# Altium schematic sheet connectors.SchDoc
size 420 x 297 mm; SheetNumber: 5; SheetTotal: 6
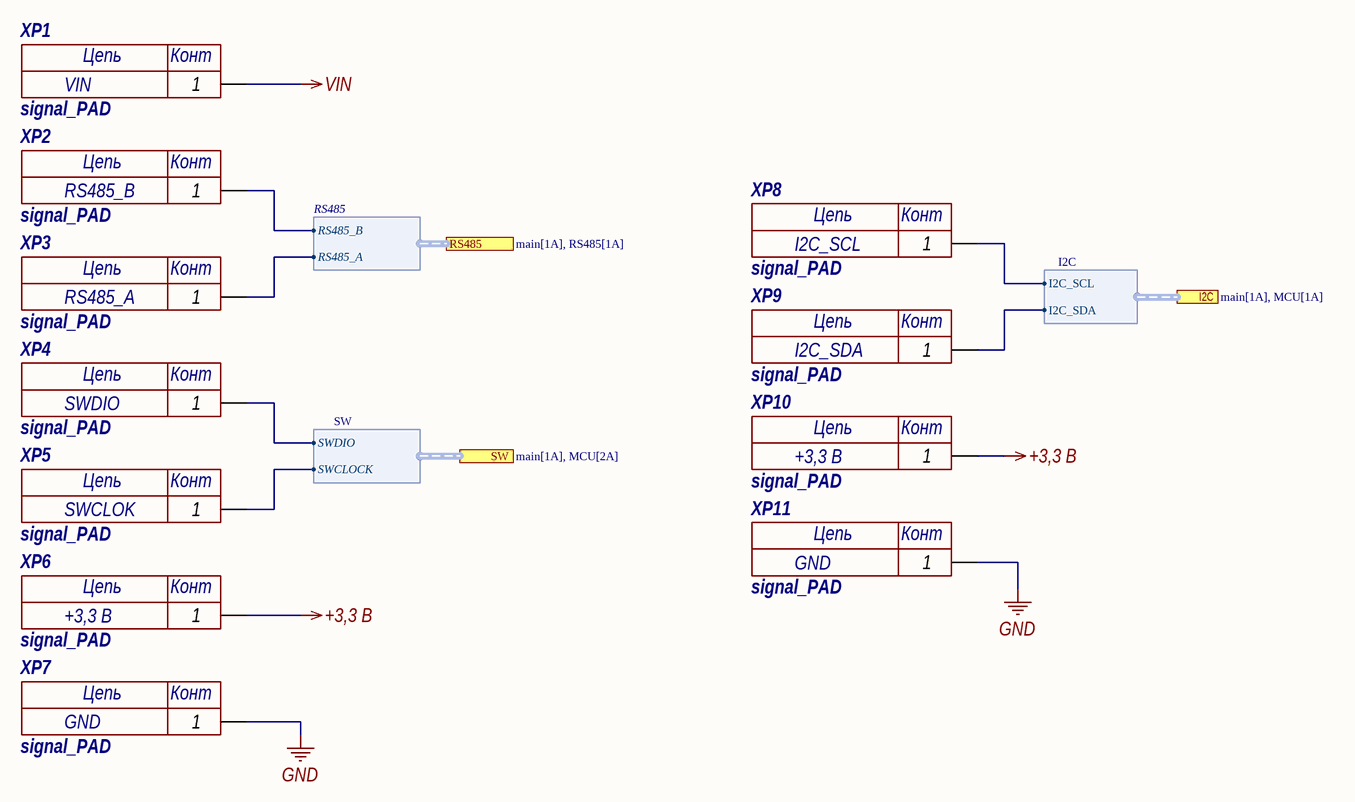
[diagram p0: connectors.SchDoc]

## Parts
XP1  signal_PAD  Value1: VIN  [SS_PAD]
XP2  signal_PAD  Value1: RS485_B  [SS_PAD]
XP3  signal_PAD  Value1: RS485_A  [SS_PAD]
XP4  signal_PAD  Value1: SWDIO  [SS_PAD]
XP5  signal_PAD  Value1: SWCLOK  [SS_PAD]
XP6  signal_PAD  Value1: +3,3 В  [SS_PAD]
XP7  signal_PAD  Value1: GND  [SS_PAD]
XP8  signal_PAD  Value1: I2C_SCL  [SS_PAD]
XP9  signal_PAD  Value1: I2C_SDA  [SS_PAD]
XP10  signal_PAD  Value1: +3,3 В  [SS_PAD]
XP11  signal_PAD  Value1: GND  [SS_PAD]

## Ports
I2C (harness I2C, see main[1A], MCU[1A]), RS485 (harness RS485, see main[1A], RS485[1A]), SW (harness SW, see main[1A], MCU[2A])

## Harnesses
I2C: I2C_SDA, I2C_SCL
SW: SWCLOCK, SWDIO
RS485: RS485_B, RS485_A

## Nets
+3,3 В: XP6.1 XP10.1
GND: XP7.1 XP11.1
VIN: XP1.1
NetXP2_1: XP2.1 ; port RS485.RS485_B
NetXP3_1: XP3.1 ; port RS485.RS485_A
NetXP4_1: XP4.1 ; port SW.SWDIO
NetXP5_1: XP5.1 ; port SW.SWCLOCK
NetXP8_1: XP8.1 ; port I2C.I2C_SCL
NetXP9_1: XP9.1 ; port I2C.I2C_SDA

## Notes on the sheet
- Перв. примен.
- Справ. №
- Подп. и дата
- Инв. № дубл.
- Взам. инв. №
- Разраб.
- Изм.
- Лист
- № докум.
- Подп.
- Дата
- Лит.
- Масса
- Масштаб
- Пров.
- Т.контр.
- Схема электрическая принципиальная
- Листов
- Инв. № подл.
- Утв.
- Н.контр.
- Копировал
- Формат А3
- (in symbol signal_PAD) Цепь; Конт

## Library data of the parts
XP1-XP11 = signal_PAD: контактная площадка под пайку тонких проводов; System: Connector; Part Number: signal_PAD